# EAGLE design BLC_3-0 (EAGLE 5.12)
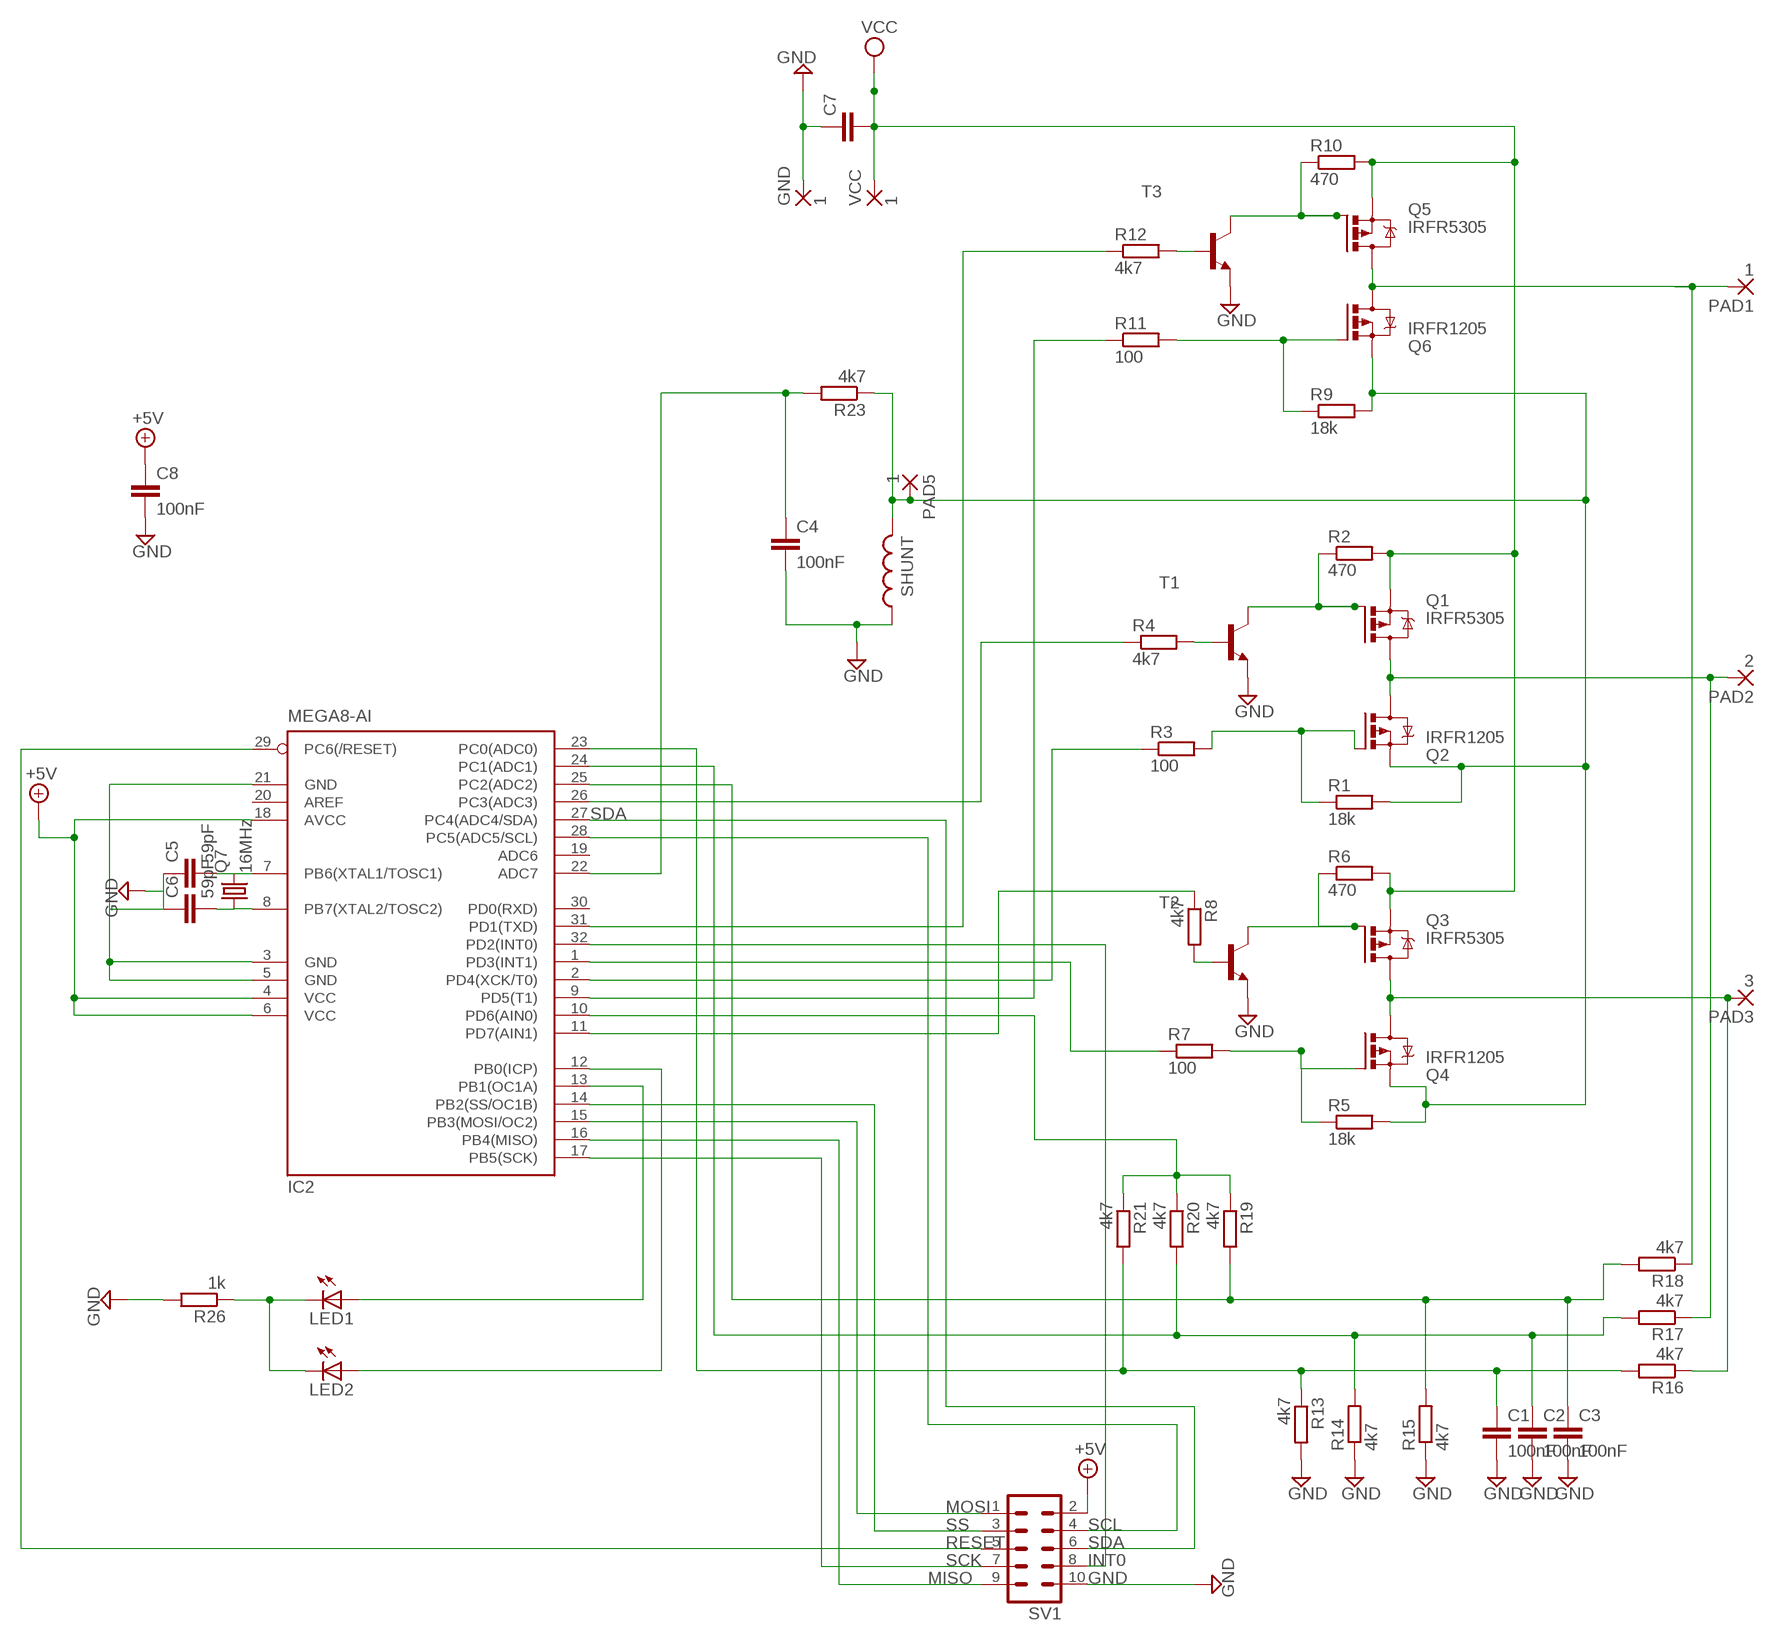
[diagram p0: schematic, sheet 1]

## Parts
C1  100nF  C5/5.5  [C5B5.5]
C2  100nF  C5/5.5  [C5B5.5]
C3  100nF  C5/5.5  [C5B5.5]
C4  100nF  C5/5.5  [C5B5.5]
C5  59pF  C5/5.5  [C5B5.5]
C6  59pF  C5/5.5  [C5B5.5]
C7  C7.5/3  [C7.5B3]
C8  100nF  C5/5.5  [C5B5.5]
GND  1  3,81/1,4  [3,81/1,4]
IC2  MEGA8-AI  [TQFP32-08]
LED1  LED3MM  [LED3MM]
LED2  LED3MM  [LED3MM]
PAD1  1  3,81/1,4  [3,81/1,4]
PAD2  2  3,81/1,4  [3,81/1,4]
PAD3  3  3,81/1,4  [3,81/1,4]
PAD5  1  1,6/0,8  [1,6/0,8]
Q1  IRFR5305  [D-PAK_TO252AA]
Q2  IRFR1205  IRFR5305  [D-PAK_TO252AA]
Q3  IRFR5305  [D-PAK_TO252AA]
Q4  IRFR1205  IRFR5305  [D-PAK_TO252AA]
Q5  IRFR5305  [D-PAK_TO252AA]
Q6  IRFR1205  IRFR5305  [D-PAK_TO252AA]
Q7  16MHz  CRYSTALHC49U-V  [HC49U-V]
R1  18k  R-EU_M0805  [M0805]
R2  470  R-EU_M0805  [M0805]
R3  100  R-EU_M0805  [M0805]
R4  4k7  R-EU_M0805  [M0805]
R5  18k  R-EU_M0805  [M0805]
R6  470  R-EU_M0805  [M0805]
R7  100  R-EU_M0805  [M0805]
R8  4k7  R-EU_M0805  [M0805]
R9  18k  R-EU_M0805  [M0805]
R10  470  R-EU_M0805  [M0805]
R11  100  R-EU_M0805  [M0805]
R12  4k7  R-EU_M0805  [M0805]
R13  4k7  R-EU_M0805  [M0805]
R14  4k7  R-EU_M0805  [M0805]
R15  4k7  R-EU_M0805  [M0805]
R16  4k7  R-EU_M0805  [M0805]
R17  4k7  R-EU_M0805  [M0805]
R18  4k7  R-EU_M0805  [M0805]
R19  4k7  R-EU_M0805  [M0805]
R20  4k7  R-EU_M0805  [M0805]
R21  4k7  R-EU_M0805  [M0805]
R23  4k7  R-EU_M0805  [M0805]
R26  1k  R-EU_M0805  [M0805]
SHUNT  L-US0207/7  [0207/7]
SV1  MA05-2  [MA05-2]
T1  BC846  [SOT23]
T2  BC846  [SOT23]
T3  BC847  [SOT23]
VCC  1  3,81/1,4  [3,81/1,4]

## Nets
+5V: C8.1 IC2.4(VCC) IC2.6(VCC) IC2.18(AVCC) SV1.2
GND: C1.2 C2.2 C3.2 C4.2 C5.1 C6.1 C7.1 C8.2 GND.1(P) IC2.3(GND) IC2.5(GND) IC2.21(GND) R13.2 R14.1 R15.1 R26.2 SHUNT.1 SV1.10 T1.2(E) T2.2(E) T3.2(E)
INT0: IC2.32(PD2(INT0)) SV1.8
MISO: IC2.16(PB4(MISO)) SV1.9
MOSI: IC2.15(PB3(MOSI/OC2)) SV1.1
N$1: R4.2 T1.1(B)
N$2: Q1.1(G) R2.1 T1.3(C)
N$4: Q2.1(G) R1.1 R3.2
N$5: R8.2 T2.1(B)
N$6: Q3.1(G) R6.1 T2.3(C)
N$8: Q4.1(G) R5.1 R7.2
N$9: R12.2 T3.1(B)
N$10: Q5.1(G) R10.1 T3.3(C)
N$11: PAD1.1(P) Q5.4(D) Q6.4(D) R18.1
N$12: Q6.1(G) R9.1 R11.2
N$13: IC2.1(PD3(INT1)) R7.1
N$14: IC2.2(PD4(XCK/T0)) R3.1
N$15: IC2.9(PD5(T1)) R11.1
N$16: IC2.11(PD7(AIN1)) R8.1
N$17: IC2.26(PC3(ADC3)) R4.1
N$18: IC2.31(PD1(TXD)) R12.1
N$19: IC2.10(PD6(AIN0)) R19.1 R20.1 R21.1
N$20: C1.1 IC2.23(PC0(ADC0)) R13.1 R16.2 R21.2
N$21: C2.1 IC2.24(PC1(ADC1)) R14.2 R17.2 R20.2
N$22: C3.1 IC2.25(PC2(ADC2)) R15.2 R18.2 R19.2
N$27: PAD3.1(P) Q3.4(D) Q4.4(D) R16.1
N$28: LED1.K(C) LED2.K(C) R26.1
N$29: C4.1 IC2.22(ADC7) R23.2
N$31: PAD2.1(P) Q1.4(D) Q2.4(D) R17.1
N$32: C7.2 Q1.3(S) Q3.3(S) Q5.3(S) R2.2 R6.2 R10.2 VCC.1(P) ; supply symbol labelled VCC
N$33: PAD5.1(P) Q2.3(S) Q4.3(S) Q6.3(S) R1.2 R5.2 R9.2 R23.1 SHUNT.2
N$35: IC2.13(PB1(OC1A)) LED1.A
N$38: C6.2 IC2.8(PB7(XTAL2/TOSC2)) Q7.1
N$39: C5.2 IC2.7(PB6(XTAL1/TOSC1)) Q7.2
N$42: IC2.12(PB0(ICP)) LED2.A
RESET: IC2.29(PC6(/RESET)) SV1.5
SCK: IC2.17(PB5(SCK)) SV1.7
SCL: IC2.28(PC5(ADC5/SCL)) SV1.4
SDA: IC2.27(PC4(ADC4/SDA)) SV1.6
SS: IC2.14(PB2(SS/OC1B)) SV1.3
Unconnected: IC2.19(ADC6) IC2.20(AREF) IC2.30(PD0(RXD))

## Library data of the parts
C1-C8 = capacitor-wima:C: CAPACITOR naming: grid - package width
GND PAD1-PAD3 VCC = wirepad:3,81/1,4: THROUGH-HOLE PAD
IC2 = atmel:MEGA8: MICROCONTROLLER 8 Kbytes FLASH, 1 kbytes SRAM, 512 bytes EEPROM, USART, 6-channel 10 bit ADC, 2-channel 8 bit ADC Pin compatible with Atmega48, ATMega88, ATMega168 Source: avr.lbr
LED1 LED2 = led:LED: LED OSRAM: - CHIPLED LG R971, LG N971, LY N971, LG Q971, LY Q971, LO R971, LY R971 LH N974, LH R974 LS Q976, LO Q976, LY Q976 LO Q996 - Hyper CHIPLED LW Q18S LB Q993, LB Q99A, LB R99A - SideLED LS A670, LO A670, LY A670, LG A670, LP A670 LB A673, LV A673, LT A673, LW A673 LH A674 LY A675 LS A676, LA A676, LO A676, LY A676, LW A676 LS A679, LY A679, LG A679 - Hyper Micro SIDELED® LS Y876, LA Y876, LO Y876, LY Y876 LT Y87S - SmartLED LW L88C, LW L88S LB L89C, LB L89S, LG L890 LS L89K, LO L89K, LY L89K LS L896, LA L896, LO L896, LY L896 - TOPLED LS T670, LO T670, LY T670, LG T670, LP T670 LSG T670, LSP T670, LSY T670, LOP T670, LYG T670 LG T671, LOG T671, LSG T671 LB T673, LV T673, LT T673, LW T673 LH T674 LS T676, LA T676, LO T676, LY T676, LB T676, LH T676, LSB T676, LW T676 LB T67C, LV T67C, LT T67C, LS T67K, LO T67K, LY T67K, LW E67C LS E67B, LA E67B, LO E67B, LY E67B, LB E67C, LV E67C, LT E67C LW T67C LS T679, LY T679, LG T679 LS T770, LO T770, LY T770, LG T770, LP T770 LB T773, LV T773, LT T773, LW T773 LH T774 LS E675, LA E675, LY E675, LS T675 LS T776, LA T776, LO T776, LY T776, LB T776 LHGB T686 LT T68C, LB T68C - Hyper Mini TOPLED® LB M676 - Mini TOPLED Santana® LG M470 LS M47K, LO M47K, LY M47K Source: http://www.osram.convergy.de LUXEON: - LUMILED® LXK2-PW12-R00, LXK2-PW12-S00, LXK2-PW14-U00, LXK2-PW14-V00 LXK2-PM12-R00, LXK2-PM12-S00, LXK2-PM14-U00 LXK2-PE12-Q00, LXK2-PE12-R00, LXK2-PE12-S00, LXK2-PE14-T00, LXK2-PE14-U00 LXK2-PB12-K00, LXK2-PB12-L00, LXK2-PB12-M00, LXK2-PB14-N00, LXK2-PB14-P00, LXK2-PB14-Q00 LXK2-PR12-L00, LXK2-PR12-M00, LXK2-PR14-Q00, LXK2-PR14-R00 LXK2-PD12-Q00, LXK2-PD12-R00, LXK2-PD12-S00 LXK2-PH12-R00, LXK2-PH12-S00 LXK2-PL12-P00, LXK2-PL12-Q00, LXK2-PL12-R00 Source: www.luxeon.com KINGBRIGHT: KA-3528ASYC Source: www.kingbright.com
PAD5 = wirepad:1,6/0,8: THROUGH-HOLE PAD
Q1-Q6 = transistor-power:IRF?5305: HEXFET Power MOSFET Source: http://www.irf.com/product-info/datasheets/data/irfr5305pbf.pdf
Q7 = crystal:CRYSTAL: CRYSTAL; OC_FARNELL: 1666969; OC_NEWARK: unknown
R1-R21 R23 R26 = rcl:R-EU_: RESISTOR, European symbol
SHUNT = resistor:L-US: INDUCTOR, American symbol
SV1 = con-lstb:MA05-2: PIN HEADER
T1 T2 = transistor:BC846: NPN TRANSISTOR
T3 = transistor:BC847: NPN TRANSISTOR

## Board
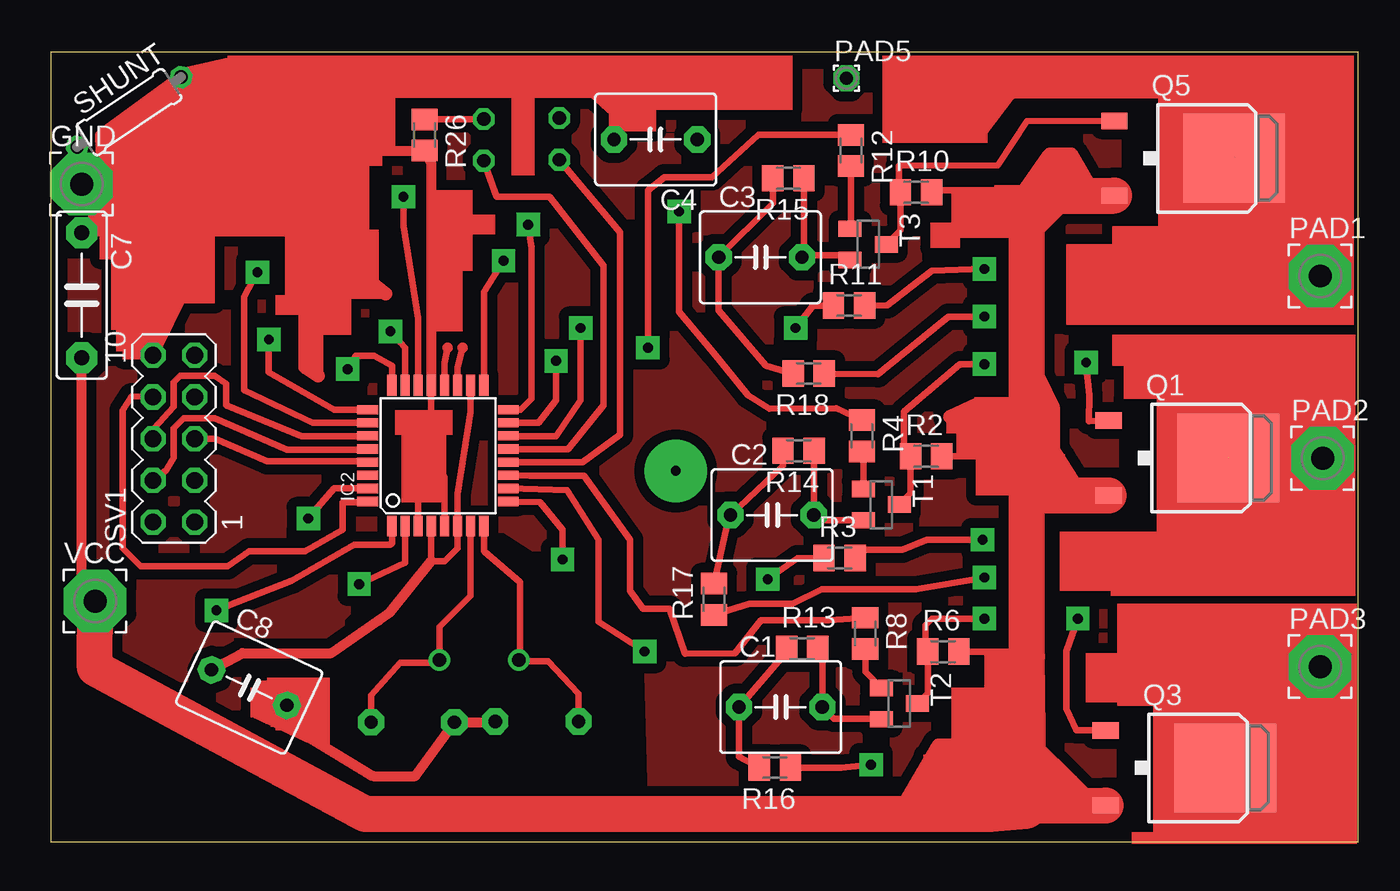
[diagram p1: board, top side]
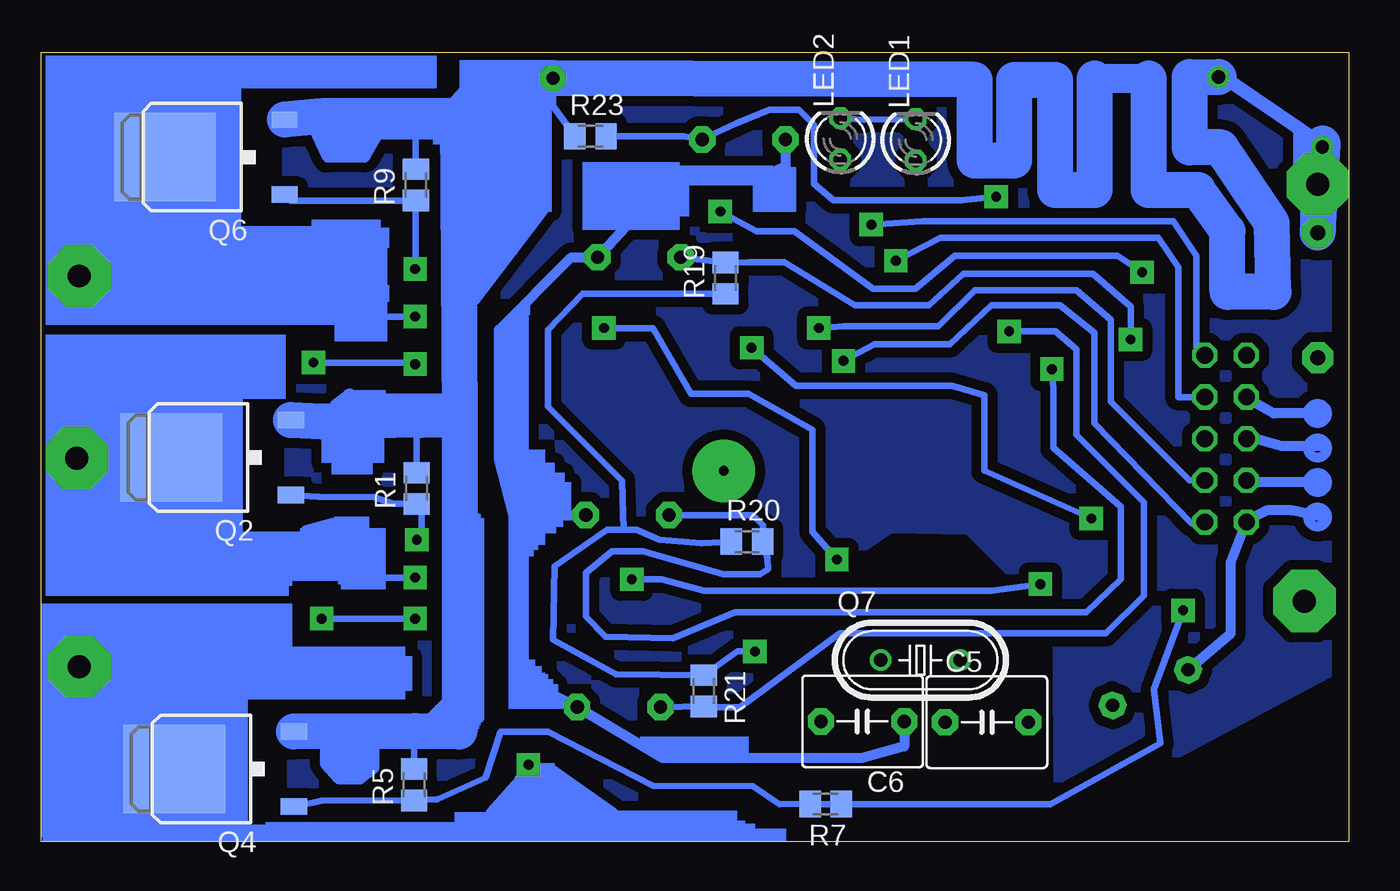
[diagram p2: board, bottom side, seen from below]

Size 79.68 x 48.09 mm. Coordinates in mm from the lower left corner, seen from the top.
Outline: 0,0 79.68,0 79.68,48.09 0,48.09 0,0
Copper layers (1*16): Top 0.035mm / dielectric 1.5mm / Bottom 0.035mm
Design rules "default": minimum track width 10mil, minimum drill 24mil, track to track 8mil, track to pad 8mil, pad to pad 8mil, via to via 8mil, smd to smd 8mil, copper to edge 40mil, drill to drill 8mil, minimum pad ring 10mil, minimum via ring 8mil, stop-mask expansion 4mil, vias tented up to drill 0mil, thermal gap 10mil

### Footprints (pad centres in the part's own frame; a part is rotated, then mirrored left to right if it is on the bottom)
C5B5.5 = drill 0.813 pad 1.6 octagon: 1 -2.54,0; 2 2.54,0
C7.5B3 = drill 0.914 pad 1.905 octagon: 1 -3.81,0; 2 3.81,0
3,81/1,4 = drill 1.397 pad 3.81 octagon: 1 0,0
TQFP32-08 = smd 1.27 x 0.559: 1 -4.293,2.8; 2 -4.293,2; 3 -4.293,1.2; 4 -4.293,0.4; 5 -4.293,-0.4; 6 -4.293,-1.2; 7 -4.293,-2; 8 -4.293,-2.8; 17 4.293,-2.8; 18 4.293,-2; 19 4.293,-1.2; 20 4.293,-0.4; 21 4.293,0.4; 22 4.293,1.2; 23 4.293,2; 24 4.293,2.8 | smd 0.559 x 1.27: 9 -2.8,-4.293; 10 -2,-4.293; 11 -1.2,-4.293; 12 -0.4,-4.293; 13 0.4,-4.293; 14 1.2,-4.293; 15 2,-4.293; 16 2.8,-4.293; 25 2.8,4.293; 26 2,4.293; 27 1.2,4.293; 28 0.4,4.293; 29 -0.4,4.293; 30 -1.2,4.293; 31 -2,4.293; 32 -2.8,4.293
LED3MM = drill 0.813 octagon: A -1.27,0; K 1.27,0
1,6/0,8 = drill 0.813 pad 1.6 octagon: 1 0,0
D-PAK_TO252AA = smd 1 x 1.6: 1 -2.28,-4.8; 3 2.28,-4.8 | smd 5.4 x 6.2: 4 0,2.5
HC49U-V = drill 0.813 round: 1 -2.413,0; 2 2.413,0
M0805 = smd 1.3 x 1.6: 1 -0.95,0; 2 0.95,0
0207/7 = drill 0.813 octagon: 1 -3.81,0; 2 3.81,0
MA05-2 = drill 1.016 octagon: 1 -5.08,-1.27; 2 -5.08,1.27; 3 -2.54,-1.27; 4 -2.54,1.27; 5 0,-1.27; 6 0,1.27; 7 2.54,-1.27; 8 2.54,1.27; 9 5.08,-1.27; 10 5.08,1.27
SOT23 = smd 1 x 1.4: 1 -0.95,-1.1; 2 0.95,-1.1; 3 0,1.1

### Placement (x,y rotation side)
C1  44.49,8.21 0 top
C2  43.97,19.91 0 top
C3  43.25,35.61 0 top
C4  36.87,42.79 180 top
C5  22.07,7.29 0 bottom
C6  29.63,7.34 180 bottom
C7  1.9,33.3 270 top
C8  12.1,9.4 334.8 top
GND  1.89,40.07 0 top
IC2  23.6,23.53 90 top
LED1  26.39,42.76 90 bottom
LED2  30.99,42.82 90 bottom
PAD1  77.37,34.47 0 top
PAD2  77.52,23.37 0 top
PAD3  77.37,10.67 0 top
PAD5  48.5,46.52 0 top
Q1  69.27,23.38 270 top
Q2  69.27,23.41 90 bottom
Q3  69.09,4.51 270 top
Q4  69.09,4.44 90 bottom
Q5  69.62,41.64 270 top
Q6  69.65,41.71 90 bottom
Q7  26.11,11.07 0 bottom
R1  56.81,21.54 90 bottom
R2  53.36,23.49 0 top
R3  48.08,17.29 0 top
R4  49.44,24.74 270 top
R5  56.96,3.48 90 bottom
R6  54.4,11.59 0 top
R7  31.88,2.31 180 bottom
R8  49.64,12.7 270 top
R9  56.86,40.02 90 bottom
R10  52.74,39.57 0 top
R11  48.66,32.67 0 top
R12  48.77,42.12 270 top
R13  45.8,11.77 0 top
R14  45.58,23.83 180 top
R15  44.96,40.43 180 top
R16  44.14,4.53 180 top
R17  40.43,14.78 90 top
R18  46.2,28.53 180 top
R19  37.99,34.34 90 bottom
R20  36.68,18.29 0 bottom
R21  39.31,9.2 270 bottom
R23  46.22,42.99 0 bottom
R26  22.79,43.06 270 top
SHUNT  4.78,44.46 33.9 top
SV1  7.51,24.56 90 top
T1  50.62,20.54 270 top
T2  51.72,8.42 270 top
T3  49.82,36.4 270 top
VCC  2.71,14.67 0 top

### Tracks (layer width: path | path; a pad name or v marks a point on that pad's centre or on a via)
+5V
  Top 0.406: IC2.4 23.2,17.1 24,17.1 24.8,17.9 IC2.6 24.8,21.2 25.6,26.2 IC2.18
  Top 0.61: 23.2,17.1 20.7,14 20,13.5 17.1,11.5 11.7,11.5 C8.1
  Bottom 0.61: SV1.2 7.2,17.02 7.2,12.7 C8.1
GND
  Top 0.406: T2.2 50.58,7.51 47.73,7.51 C1.2 47.03,12.29 R13.2 | R14.1 46.53,19.73 C2.2 46.73,19.59 T1.2 | 45.91,35.73 R15.1 | C3.2 45.91,35.73 | 45.91,35.73 48.44,35.73 T3.2 | IC2.5 24,22.2 23.2,23.6 | 23.2,23.6 22.4,22.2 IC2.3 | IC2.21 23.2,23.6
  Top 0.61: 16,45.6 20.19,42.11 R26.2 23.2,41.3 IC2.21 | 16,45.6 10.82,45.6 GND.1 6.24,35.72 SV1.10 | C4.2 34.33,44.47 33.1,45.6 16,45.6 | C8.2 15.7,6.4 19.66,4 22.22,4 C5.1 27.04,7.29 C6.1
  Bottom 0.61: 50.9,19.9 51.8,23.3 51.8,31.2 47.39,35.61 C3.2 41.3,40.5 35.9,40.5 34.31,41.19 C4.2 | 50.9,19.9 50.9,10.18 C1.2 41.82,5.1 29.7,5.1 27.09,5.81 C6.1 | 50.9,19.9 49.4,19.9 C2.2
  Bottom 2.184: GND.1 1.89,38.92 C7.1 1.6,42.55 SHUNT.1
INT0
  Top 0.406: SV1.8 4.94,27.14 4.4,26.3 4.4,17.9 5.5,16.8 10.8,16.8 12.1,17.7 15.5,17.7 17.8,19 17.8,20.7 19.28,20.7 IC2.32
MISO  (via drill 0.6 pad 1.42)
  Top 0.406: IC2.16 28.63,26.33 29.3,27 29.3,36.2 v29.1,37.6
  Bottom 0.406: v29.1,37.6 26,37.8 10.7,37.8 9.3,35.7 9.3,30.16 SV1.9
MOSI  (via drill 0.6 pad 1.42)
  Top 0.406: IC2.15 29.73,25.53 30.8,26.9 v30.8,29.3
  Bottom 0.406: v30.8,29.3 28.9,30.3 24.3,30.3 21.8,32.7 17.6,32.7 15.5,31 15.5,25.5 9.6,19.4 8.86,19.4 SV1.1
N$1
  Top 0.406: R4.2 49.52,23.71 T1.1
N$2  (via drill 0.6 pad 1.42)
  Top 0.406: T1.3 52.41,21.23 R2.1 52,23.9 52,26.2 55.4,29.1 v56.9,29.1 | Q1.1 63.27,25.63 63.3,27.2 v63.1,29.2
  Bottom 0.406: v63.1,29.2 57,29.2 v56.9,29.1
N$3
  pour Bottom (isolate 0.61): 0.4,42.5 8.1,48 64.8,47.8 64.4,0.4 36.4,0.7 36.5,2.4 36.5,13.3 27.9,19.1 23.2,19 17.8,13.6 17.7,1.8 35.6,1.7 33.5,0.7 19.3,0.7 0.3,10.8
N$4  (via drill 0.6 pad 1.42)
  Top 0.406: v56.8,18.4 53.4,18.4 51.9,17.8 49.54,17.8 R3.2
  Bottom 0.406: Q2.1 62.79,21.01 59.4,21 58.2,20.6 R1.1 56.69,20.59 56.5,20.4 56.5,18.7 v56.8,18.4
N$5
  Top 0.406: T2.1 49.64,10.35 R8.2
N$6  (via drill 0.6 pad 1.42)
  Top 0.406: T2.3 53.45,9.05 R6.1 53.3,11.74 53.3,13.2 53.7,13.6 v56.9,13.6 | Q3.1 62.5,6.8 61.9,8.1 61.89,11.61 v62.6,13.6
  Bottom 0.406: v56.9,13.6 v62.6,13.6
N$7
  pour Top (isolate 0.61): 0.4,42.5 8.2,48 65,47.8 64.6,0.6 36.4,0.7 36.7,2.6 36.4,13.5 27.7,19.1 23.2,19.1 17.6,13.6 17.8,1.7 35.8,1.7 33.5,0.6 19.4,0.7 0.3,10.8
N$8
  Bottom 0.406: Q4.1 64.26,2.13 62.6,2.5 R5.1 55.53,2.6 52.6,3.9 51.7,6.7 48.8,6.7 42.41,3.41 36.3,3.4 34.7,2.3 R7.2
N$9
  Top 0.406: R12.2 48.77,37.4 T3.1
N$10
  Top 0.406: T3.3 51.79,37.27 R10.1 51.7,39.66 51.7,41.2 57.72,41.22 59.5,43.9 Q5.1
N$11  (via drill 0.6 pad 1.42)  (1 unrouted)
  Top 0.406: Q5.4 72.12,39.72 PAD1.1 | Q5.4 72.12,41.68 Q6.4 | Q5.4 71.44,41.64 | v56.9,32 54.7,32 50.42,28.5 R18.1
  Bottom 0.406: v56.9,32 74.9,32 PAD1.1
N$12  (via drill 0.6 pad 1.42)
  Top 0.406: v56.9,34.9 53.7,34.8 52.8,34.1 50.98,32.7 R11.2
  Bottom 0.406: Q6.1 64.49,39.07 R9.1 56.86,34.94 v56.9,34.9
N$13  (via drill 0.6 pad 1.42)
  Top 0.406: IC2.1 20.8,18.2 20.7,18.1 18.5,18.1 14.7,15.9 v10.1,14.1
  Bottom 0.406: v10.1,14.1 11.9,9.3 11.5,6 18.2,2.3 32.64,2.3 R7.1
N$14  (via drill 0.6 pad 1.42)
  Top 0.406: R3.1 45.51,17.29 v43.7,16 | v18.8,15.7 21.6,17 IC2.2
  Bottom 0.406: v43.7,16 41.9,16 39.3,15.3 21.8,15.3 v18.8,15.7
N$15  (via drill 0.6 pad 1.42)
  Top 0.406: R11.1 46.47,32.67 v45.4,31.3 | v31.2,17.2 31.2,19 29.82,20.7 IC2.9
  Bottom 0.406: v31.2,17.2 32.7,18.9 32.7,25.1 36.6,27.3 40.1,27.3 42.4,31.3 v45.4,31.3
N$16
  Top 0.406: R8.1 47.4,13.5 43.3,13.5 41.7,11.5 38.65,11.45 37.7,14.2 36.1,14.2 35.3,15.3 35.3,18.4 32.5,22.3 29.22,22.3 IC2.11
N$17  (via drill 0.6 pad 1.42)
  Top 0.406: R4.1 47.9,26.4 43.8,26.39 42.5,27.2 40.4,29.8 38.3,32.29 v38.3,38.4 | IC2.26 15.97,25.53 11.8,27.5 11.8,33.2 v12.6,34.7
  Bottom 0.406: v12.6,34.7 14.1,35.7 24,35.7 26.4,33.7 29,33.7 33.8,37.2 36.1,37.2 v38.3,38.4
N$18  (via drill 0.6 pad 1.42)
  Top 0.406: R12.1 43.13,43.07 40.3,40.5 37.4,40.5 36.4,39.7 v36.4,30.1 | v15.7,19.7 17.27,21.53 IC2.31
  Bottom 0.406: v36.4,30.1 33.7,27.8 24.2,27.8 22.2,27.2 22.2,22.6 v15.7,19.7
N$19  (via drill 0.6 pad 1.42)
  Top 0.406: IC2.10 31.47,21.43 33.4,18.4 33.4,13.4 v36.2,11.6
  Bottom 0.406: 44.2,19 45.2,19 48.4,16.8 48.5,12.3 44.66,10.2 R21.1 37.26,11.6 v36.2,11.6 | 44.2,19 43.4,19 42,18.4 39.46,18.2 R20.1 | R19.1 46.71,33.39 48.8,31.2 48.8,26.5 44.3,22 44.2,19
N$20  (via drill 0.6 pad 1.42)
  Top 0.406: R13.1 44.55,11.21 C1.1 41.95,5.17 R16.2 | IC2.23 21.6,30.1 v20.7,31.1
  Bottom 0.406: C1.1 R21.2 39.26,8.2 37.1,8.2 31,12.7 14.8,12.7 12.5,15 12.5,20.7 16.6,24.8 16.6,30 17.9,31.1 v20.7,31.1
N$21  (via drill 0.6 pad 1.42)
  Top 0.406: R14.2 44.63,22.91 C2.1 41.27,19.55 R17.2 | IC2.24 20.8,29 19.7,29.6 18.6,29.6 v18.1,28.8
  Bottom 0.406: C2.1 39.8,19.9 36.3,19.9 35.7,19.3 R20.2 35.42,17.3 35.4,16.6 35.9,16.3 38.1,16.3 43,17.7 44.9,17.7 46.5,16.4 46.5,13.7 45.3,12.5 41.2,12.4 37.4,14 16,14 13.9,16 13.9,20.4 18,24 18,27.6 v18.1,28.8
N$22  (via drill 0.6 pad 1.42)
  Top 0.406: C3.1 40.71,32.37 43.6,29 R18.2 | C3.1 40.99,35.61 41,35.6 | R15.2 44.01,38.91 C3.1 | IC2.25 17.27,26.33 13.3,28.6 v13.3,30.6
  Bottom 0.406: C3.1 R19.2 36.6,35.3 34.4,35.3 30.1,32.7 25.6,32.7 23.5,34.6 15.6,34.6 13.3,32.6 v13.3,30.6
N$23
  Bottom 0.61: 6.3,27.1 4.6,26.1 1.6,26.1
N$24
  Bottom 0.61: 6.3,24.5 5.5,24.5 4.1,24.1 1.8,24.1
N$25
  Bottom 0.61: 1.9,21.9 6.3,21.9
N$26
  Bottom 0.61: 6.3,19.5 5,20.2 3.5,20.2 1.7,19.8
N$27  (via drill 0.6 pad 1.42)
  Top 0.406: Q3.4 71.59,4.89 PAD3.1 | R16.1 48.17,4.53 v50,4.7
  Bottom 0.406: Q4.4 71.59,4.89 PAD3.1 67.1,0.9 54.1,0.8 50,1.4 v50,4.7
N$28
  Top 0.406: R26.1 25.27,44.01 LED1.K
  Bottom 0.406: LED2.K 29.55,43.99 LED1.K
N$29  (via drill 0.6 pad 1.42)
  Top 0.406: v21.5,39.3 21.5,37.5 22.4,31.9 IC2.22
  Bottom 0.406: R23.2 40.57,42.99 C4.1 37.31,43.79 35.3,44.6 33.5,44.6 32.6,43.7 32.6,40.1 31.4,39.1 23.6,39.1 v21.5,39.3
N$30  (via drill 0.6 pad 3.81)
  other vias: 38.1,22.6
N$31  (via drill 0.6 pad 1.42)  (1 unrouted)
  Top 0.406: Q1.4 PAD2.1 | Q1.4 Q2.4 | Q1.4 71.48,23.38 | v56.9,16.1 52.74,15.4 47,15.4 45.2,14.5 42.6,14.5 R17.1
  Bottom 0.406: v56.9,16.1 70.25,16.1 PAD2.1
N$32
  Top 0.406: 59.5,37.6 59.5,37.9 57.7,39.7 53.82,39.7 R10.2 | R2.2 59.39,23.49 59.5,23.6 | R6.2 59.21,11.59 59.5,11.3
  Top 0.61: VCC.1 1.9,15.48 C7.2
  Top 2.184: Q5.3 61.26,39.36 59.5,37.6 59.5,23.6 59.5,21.1 | 59.6,2.2 59.5,1.9 57.3,1.7 19.18,1.7 2.7,10.6 VCC.1 | 59.6,2.2 59.5,11.3 59.5,21.1 | 59.6,2.2 Q3.3 | 59.5,21.1 Q1.3
N$33
  Bottom 0.406: R9.2 56.86,43.46 57.6,44.2 | R1.2 56.81,25.49 56.6,25.7 | R5.2 56.96,6.57 56.89,6.74 | R23.1 48.49,44.81 PAD5.1
  Bottom 1.778: 12.2,46.5 15.5,46.5
  Bottom 2.184: 12.2,46.5 12.2,39.7 9.2,39.7 7.4,37.2 7.4,33.5 4.6,33.5 4.7,37.7 7.8,42.3 9.7,42.3 9.7,46.6 SHUNT.2 | 15.5,46.5 15.5,39.7 17.9,39.7 17.9,46.4 20.4,46.4 20.4,41.5 22.8,41.5 22.8,46.42 PAD5.1 52.08,46.52 53.3,45.3 54.3,44.2 | Q4.3 56.89,6.74 54.2,6.71 54.2,25.7 | 54.3,44.2 54.2,25.7 | Q6.3 62.64,44.2 57.6,44.2 54.3,44.2 | Q2.3 62.56,25.6 56.6,25.7 54.2,25.7
N$34
  Bottom 0.813: 1.5,42.4 7.8,46.7
N$35
  Top 0.406: IC2.13 31.53,23.93 33.7,26.6 33.7,35.1 30.4,39.3 27.18,39.3 LED1.A
N$36
  Top 0.406: 24,27.6 24,29.2 24.2,30.1
N$37
  Top 0.406: 24.8,27.7 24.8,28.9 25.1,30.1
N$38
  Top 0.406: C6.2 32.17,9.03 30.3,11 29.19,11 Q7.1 28.6,11.55 28.6,15.8 26.4,17.7 IC2.8
N$39
  Top 0.406: C5.2 19.53,8.93 21.3,10.9 23.53,10.9 Q7.2 23.7,13.1 25.6,15 IC2.7
N$40
  Top 0.813: 11,47.4 8.3,46.8 3.1,43 3.2,40.6
N$41
  Top 0.813: 56.7,43.3 58.9,46.2
N$42
  Top 0.406: IC2.12 32.43,23.13 34.7,24.8 34.7,37.14 LED2.A
N$43
  Top 0.813: 59.4,39.8 60.8,41.8 60.1,40.2
N$44
  Top 0.813: 60.9,41.9 62.2,41.9 63.3,40
N$45
  Top 0.813: 54.8,25.9 56.5,26.7
N$46
  Top 0.813: 61.1,26.4 60.2,28.3
N$47
  Top 0.813: 62.6,21.5 60.7,24.5
N$48
  Top 0.813: 52,2.3 54.1,5.9 57.4,5.9
N$49
  Top 0.813: 59.1,6.2 62.8,3.1 59.4,6.5
N$50
  Top 0.813: 6.2,29.8 8.1,33.7
N$51
  Top 0.813: 18.9,34.6 20.4,33.4
N$52
  Top 0.813: 15.5,28.9 16.3,28.4
N$53
  Bottom 0.813: 52.2,1.7 49.9,4.3
N$54
  Bottom 0.813: 44.9,1.7 48.7,4.4
N$55
  Bottom 0.813: 61.5,3.9 62.3,4.8 62.3,5.8
N$56
  Bottom 0.813: 60.3,3.9 59.5,4.5 59.5,5.8
N$57
  Bottom 0.813: 54.9,8.5 55.9,7.5
N$58
  Bottom 0.813: 61.6,19.4 63.5,18.9
N$59
  Bottom 0.813: 60.9,27.2 61.7,26.6
N$60
  Bottom 0.813: 49.1,38.6 53.3,33.1 53.8,33.6 49.5,38.7
N$61
  Bottom 0.813: 59.3,43 60,41.8
N$62
  Bottom 0.813: 62.2,41.8 62.8,43.1
N$63
  Top 0.813: 16,6.3 12.6,7.9
RESET
  Top 0.406: SV1.5 10.04,24.56 13.2,23.2 19.24,23.2 IC2.29
SCK  (via drill 0.6 pad 1.42)
  Top 0.406: v27.6,35.4 26.4,33.52 IC2.17
  Bottom 0.406: SV1.7 10.4,27.1 10.4,35 11.6,36.8 24.9,36.8 v27.6,35.4
SCL
  Top 0.406: SV1.4 7.04,22.64 7.5,23.4 7.5,25.2 8.1,25.8 10,25.8 14.4,23.9 19.14,23.9 IC2.28
SDA
  Top 0.406: SV1.6 6.3,25.2 7.5,26.5 7.5,28 7.9,28.4 10,28.4 10.7,27.9 10.7,26.6 15.3,24.7 19.28,24.7 IC2.27
SS  (via drill 0.6 pad 1.42)
  Top 0.406: v32.3,31.3 32.3,26.9 30.8,24.7 27.92,24.7 IC2.14
  Bottom 0.406: SV1.3 9.72,22.02 14.5,26.8 14.5,31.8 16.6,33.6 22.8,33.6 25,31.4 30.8,31.4 v32.3,31.3
(copper drawn outside any net)
  shapes: Bottom area x104, Bottom circle x4, Top area x113, Top circle x2